# Altium project ECU V1.0 B.PrjPcb (part 17 of 17)
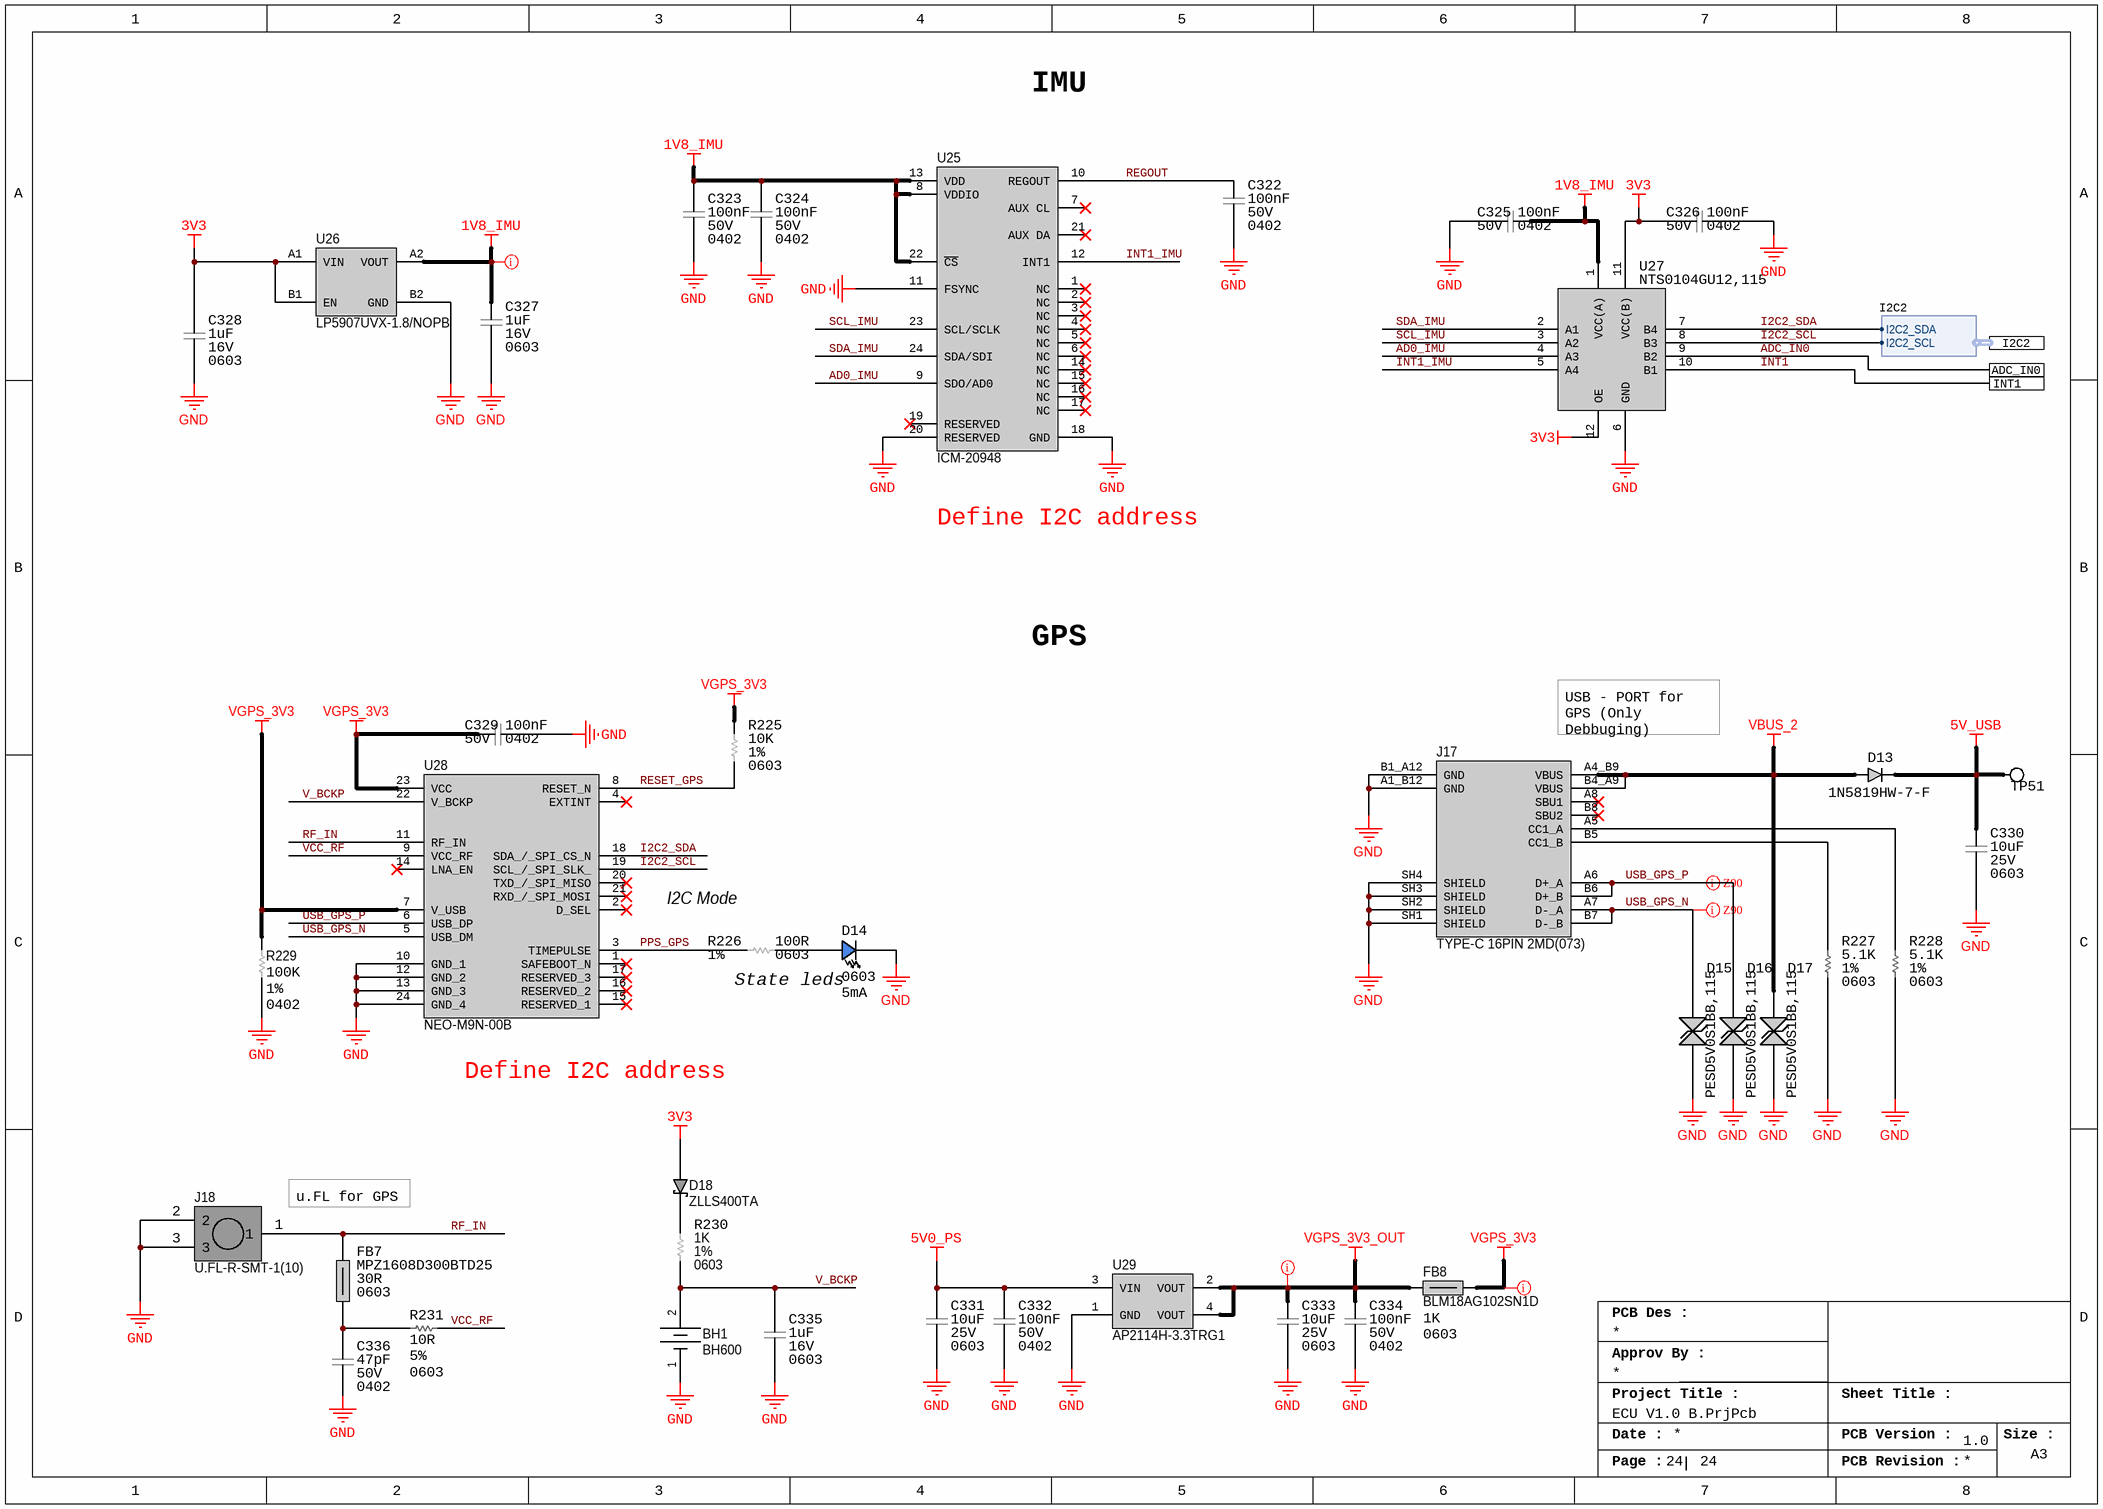
[diagram p23: 23_IMU_GPS.SchDoc]

## Nets that join several sheets
1V8: 03_iMX 8X_PMIC (R237.2), 05_iMX 8X_PCIE (5 pins), 07_iMX 8X_LPDDR4 (L6.1), 08_iMX 8X_MEMORY (11 pins), 10_iMX 8X_ETH (R53.1), 11_iMX 8X_SPI & ADC (12 pins), 13_iMX 8X_SYSTEM (J4.3 J5.3), 17_CAN_BUS (C250.2 R96.2 U8.1), 19_WIFI_BLE (15 pins), 20_V2X_MODEM (C303.2 R177.1 U18.1), 21_GPIOs_EXP (R199.2 R217.2)
3V3: 02_PWR IN (R233.2), 05_iMX 8X_PCIE (C83.2 C84.2 U1.L9), 11_iMX 8X_SPI & ADC (L7.1), 17_CAN_BUS (5 pins), 19_WIFI_BLE (29 pins), 20_V2X_MODEM (13 pins), 21_GPIOs_EXP (40 pins), 23_IMU_GPS (7 pins)
3V3_PS: 02_PWR IN (22 pins), 03_iMX 8X_PMIC (R232.1)
5V0_PS: 02_PWR IN (22 pins), 03_iMX 8X_PMIC (C45.2 U2.19), 17_CAN_BUS (C245.2 C246.2 C247.1 U7.3), 20_V2X_MODEM (R179.1 R180.2), 22_Nvidia_CAN (FB6.1), 23_IMU_GPS (C331.2 C332.2 U29.3)
12V0: 02_PWR IN (11 pins), 04_iMX 8X_PWR (R1.1 R2.1), 20_V2X_MODEM (R178.2)
GND: 02_PWR IN (62 pins), 03_iMX 8X_PMIC (44 pins), 04_iMX 8X_PWR (149 pins), 05_iMX 8X_PCIE (10 pins), 07_iMX 8X_LPDDR4 (18 pins), 08_iMX 8X_MEMORY (6 pins), 10_iMX 8X_ETH (C115.1 C116.1 C117.1), 11_iMX 8X_SPI & ADC (15 pins), 13_iMX 8X_SYSTEM (11 pins), 14_JTAG_DBG (J9.03 J9.05 R84.1 R85.1), 16_LPDDR (97 pins), 17_CAN_BUS (33 pins), 19_WIFI_BLE (68 pins), 20_V2X_MODEM (44 pins), 21_GPIOs_EXP (9 pins), 22_Nvidia_CAN (13 pins), 23_IMU_GPS (41 pins)
PMIC_VDD_DDRIO: 02_PWR IN (R236.2), 03_iMX 8X_PMIC (7 pins)
VDD_ANA: 13_iMX 8X_SYSTEM (J4.1 J5.1 R59.2 R60.2), 14_JTAG_DBG (R80.2 R81.2 R82.2 R83.2)
VDD_DDR_VDDQ: 07_iMX 8X_LPDDR4 (24 pins), 16_LPDDR (R90.2 R91.2)
3V3_5V0_PS_EN: 02_PWR IN (U3.22), 04_iMX 8X_PWR (D1.1 Q1.D)
ADC_IN0: 11_iMX 8X_SPI & ADC (U1.AD34), 23_IMU_GPS (U27.9)
BT_DIS_B: 19_WIFI_BLE (J13.54), 21_GPIOs_EXP (R201.1 U23.4)
BT_UART_WAKE_B: 19_WIFI_BLE (J13.20), 21_GPIOs_EXP (R202.1 U23.5)
CAN1_CANH: 17_CAN_BUS (5 pins), 22_Nvidia_CAN (R224.2)
CAN1_CANL: 17_CAN_BUS (5 pins), 22_Nvidia_CAN (R218.2)
DDR_CA0_A: 07_iMX 8X_LPDDR4 (U1.W1), 16_LPDDR (U6.H2)
DDR_CA1_A: 07_iMX 8X_LPDDR4 (U1.U1), 16_LPDDR (U6.J2)
DDR_CA2_A: 07_iMX 8X_LPDDR4 (U1.N1), 16_LPDDR (U6.H9)
DDR_CA3_A: 07_iMX 8X_LPDDR4 (U1.N3), 16_LPDDR (U6.H10)
DDR_CA4_A: 07_iMX 8X_LPDDR4 (U1.J1), 16_LPDDR (U6.H11)
DDR_CA5_A: 07_iMX 8X_LPDDR4 (U1.J3), 16_LPDDR (U6.J11)
DDR_CKE0_A: 07_iMX 8X_LPDDR4 (R35.2 U1.T2), 16_LPDDR (U6.J4)
DDR_CLKA_N: 07_iMX 8X_LPDDR4 (U1.K2), 16_LPDDR (U6.J9)
DDR_CLKA_P: 07_iMX 8X_LPDDR4 (U1.L1), 16_LPDDR (U6.J8)
DDR_CS0_A: 07_iMX 8X_LPDDR4 (U1.R1), 16_LPDDR (U6.H4)
DDR_DMI1: 07_iMX 8X_LPDDR4 (U1.AE1), 16_LPDDR (U6.C10)
DDR_DMIO: 07_iMX 8X_LPDDR4 (U1.AN3), 16_LPDDR (U6.C3)
DDR_DQ0: 07_iMX 8X_LPDDR4 (U1.AJ1), 16_LPDDR (U6.B2)
DDR_DQ1: 07_iMX 8X_LPDDR4 (U1.AK2), 16_LPDDR (U6.C2)
DDR_DQ2: 07_iMX 8X_LPDDR4 (U1.AL1), 16_LPDDR (U6.E2)
DDR_DQ3: 07_iMX 8X_LPDDR4 (U1.AM2), 16_LPDDR (U6.F2)
DDR_DQ4: 07_iMX 8X_LPDDR4 (U1.AR3), 16_LPDDR (U6.F4)
DDR_DQ5: 07_iMX 8X_LPDDR4 (U1.AP4 U1.AR5), 16_LPDDR (U6.C4 U6.E4)
DDR_DQ7: 07_iMX 8X_LPDDR4 (U1.AP6), 16_LPDDR (U6.B4)
DDR_DQ8: 07_iMX 8X_LPDDR4 (U1.AJ3), 16_LPDDR (U6.B11)
DDR_DQ9: 07_iMX 8X_LPDDR4 (U1.AH2), 16_LPDDR (U6.C11)
DDR_DQ10: 07_iMX 8X_LPDDR4 (U1.AG1), 16_LPDDR (U6.E11)
DDR_DQ11: 07_iMX 8X_LPDDR4 (U1.AF2), 16_LPDDR (U6.F11)
DDR_DQ12: 07_iMX 8X_LPDDR4 (U1.AC1), 16_LPDDR (U6.F9)
DDR_DQ13: 07_iMX 8X_LPDDR4 (U1.AB2), 16_LPDDR (U6.E9)
DDR_DQ14: 07_iMX 8X_LPDDR4 (U1.AA1), 16_LPDDR (U6.C9)
DDR_DQ15: 07_iMX 8X_LPDDR4 (U1.AA3), 16_LPDDR (U6.B9)
DDR_DQS0_N: 07_iMX 8X_LPDDR4 (U1.AP2), 16_LPDDR (U6.E3)
DDR_DQS0_P: 07_iMX 8X_LPDDR4 (U1.AN1), 16_LPDDR (U6.D3)
DDR_DQS1_N: 07_iMX 8X_LPDDR4 (U1.AD2), 16_LPDDR (U6.E10)
DDR_DQS1_P: 07_iMX 8X_LPDDR4 (U1.AE3), 16_LPDDR (U6.D10)
DRAM_RST: 07_iMX 8X_LPDDR4 (R36.2 U1.H2), 16_LPDDR (U6.T11)
ENET0_AUX_GPIO1: 20_V2X_MODEM (U20.13), 21_GPIOs_EXP (R204.1 U23.7)
ENET0_AUX_GPIO2: 20_V2X_MODEM (U20.12), 21_GPIOs_EXP (R205.1 U23.8)
ENET0_AUX_GPIO3: 20_V2X_MODEM (U20.11), 21_GPIOs_EXP (R206.1 U23.9)
ENET0_AUX_GPIO4: 20_V2X_MODEM (U20.10), 21_GPIOs_EXP (R207.1 U23.10)
ENET0_MODULE_INH: 20_V2X_MODEM (J14.43), 21_GPIOs_EXP (R184.1 U22.5)
ENET0_MODULE_RST_B: 20_V2X_MODEM (R174.2), 21_GPIOs_EXP (R183.1 U22.4)
I2C2_SCL: 11_iMX 8X_SPI & ADC (U1.AR17), 21_GPIOs_EXP (U22.22 U23.22), 23_IMU_GPS (U27.8 U28.19)
I2C2_SDA: 11_iMX 8X_SPI & ADC (U1.AP16), 21_GPIOs_EXP (U22.23 U23.23), 23_IMU_GPS (U27.7 U28.18)
I2C3_SCL: 02_PWR IN (R68.1 U3.2), 11_iMX 8X_SPI & ADC (U1.AP18), 19_WIFI_BLE (J13.60 U10.13), 20_V2X_MODEM (J14.54)
I2C3_SDA: 02_PWR IN (R69.1 U3.3), 11_iMX 8X_SPI & ADC (U1.AR15), 19_WIFI_BLE (J13.58 U10.12), 20_V2X_MODEM (J14.52)
INT1: 21_GPIOs_EXP (R203.1 U23.6), 23_IMU_GPS (U27.10)
JTAG_SRST_B: 13_iMX 8X_SYSTEM (U1.AR29), 14_JTAG_DBG (J9.10 R80.1)
JTAG_TCK: 13_iMX 8X_SYSTEM (U1.AR33), 14_JTAG_DBG (J9.02 R82.1)
JTAG_TD0: 13_iMX 8X_SYSTEM (U1.AN31), 14_JTAG_DBG (J9.08 R81.1)
JTAG_TDI: 13_iMX 8X_SYSTEM (U1.AR31), 14_JTAG_DBG (J9.04 R85.2)
JTAG_TMS: 13_iMX 8X_SYSTEM (U1.AP32), 14_JTAG_DBG (J9.06)
PCIE0_RX_N: 05_iMX 8X_PCIE (U1.B12), 19_WIFI_BLE (R152.1)
PCIE0_RX_P: 05_iMX 8X_PCIE (U1.A13), 19_WIFI_BLE (R151.1)
PCIE0_TX_N: 05_iMX 8X_PCIE (U1.B10), 19_WIFI_BLE (C283.2)
PCIE0_TX_P: 05_iMX 8X_PCIE (U1.A11), 19_WIFI_BLE (C282.2)
PCIE_CTRL_CLKREQ_B: 05_iMX 8X_PCIE (U1.C9), 19_WIFI_BLE (R168.1 U15.1)
PCIE_CTRL_PERST_B: 05_iMX 8X_PCIE (U1.B8), 19_WIFI_BLE (R153.1)
PCIE_CTRL_WAKE_B: 05_iMX 8X_PCIE (U1.A9), 19_WIFI_BLE (J13.55 R150.1)
PCIE_REF_CLK_N: 05_iMX 8X_PCIE (R32.2), 19_WIFI_BLE (R137.1)
PCIE_REF_CLK_P: 05_iMX 8X_PCIE (R31.2), 19_WIFI_BLE (R136.1)
PMIC_I2C_SCL: 03_iMX 8X_PMIC (U2.11), 13_iMX 8X_SYSTEM (R59.1 U1.AP30)
PMIC_I2C_SDA: 03_iMX 8X_PMIC (U2.10), 13_iMX 8X_SYSTEM (R60.1 U1.AP28)
PMIC_INT_B: 03_iMX 8X_PMIC (R18.1), 13_iMX 8X_SYSTEM (U1.AN27)
PMIC_ON_REQ: 03_iMX 8X_PMIC (R17.1), 13_iMX 8X_SYSTEM (R57.1 U1.AR19)
PMIC_STBY: 03_iMX 8X_PMIC (R15.1), 13_iMX 8X_SYSTEM (U1.AN25)
PMIC_WDOG_IN: 03_iMX 8X_PMIC (R19.1), 13_iMX 8X_SYSTEM (U1.AG29)
SPI0_CS0: 11_iMX 8X_SPI & ADC (U1.AB34), 19_WIFI_BLE (R138.1)
SPI0_CS1: 11_iMX 8X_SPI & ADC (U1.AC35), 19_WIFI_BLE (R139.1)
SPI0_SCK: 11_iMX 8X_SPI & ADC (U1.Y34), 19_WIFI_BLE (R140.1)
SPI0_SDI: 11_iMX 8X_SPI & ADC (U1.AA33), 19_WIFI_BLE (R141.1)
SPI0_SDO: 11_iMX 8X_SPI & ADC (U1.AA35), 19_WIFI_BLE (R142.1)
SS_CNTRL: 19_WIFI_BLE (U14.2), 21_GPIOs_EXP (R198.1 R200.2 U22.20)
UART1_CTS_B: 11_iMX 8X_SPI & ADC (U1.AA29), 19_WIFI_BLE (J13.34)
UART1_RTS_B: 11_iMX 8X_SPI & ADC (U1.W29), 19_WIFI_BLE (J13.36)
UART1_RX: 11_iMX 8X_SPI & ADC (U1.W33), 19_WIFI_BLE (J13.22)
UART1_TX: 11_iMX 8X_SPI & ADC (U1.W35), 19_WIFI_BLE (J13.32)
V2X_PMIC_STBY: 20_V2X_MODEM (U21.2), 21_GPIOs_EXP (R210.1 U23.14)
WIFI_DIS_B: 19_WIFI_BLE (J13.56), 21_GPIOs_EXP (R196.1 U22.18)
WIFI_EN: 19_WIFI_BLE (U10.10), 21_GPIOs_EXP (R195.1 U22.17)
WIFI_WAKE_B: 19_WIFI_BLE (U10.11), 21_GPIOs_EXP (R197.1 U22.19)

## Assembly variants
Base Variant: not fitted D9 D10 D11 D12 D13 D14 D15 D16 J16 J16 R44 R44 R89 R93 R98 R102 R107 R111 R115 R119